# Altium schematic sheet FPGA_GPIO.SchDoc: ARDUINO_SYZGY
size 420 x 297 mm; DrawnBy: Orhun Dabak; Revision: 1.0; SheetNumber: 7; SheetTotal: 7
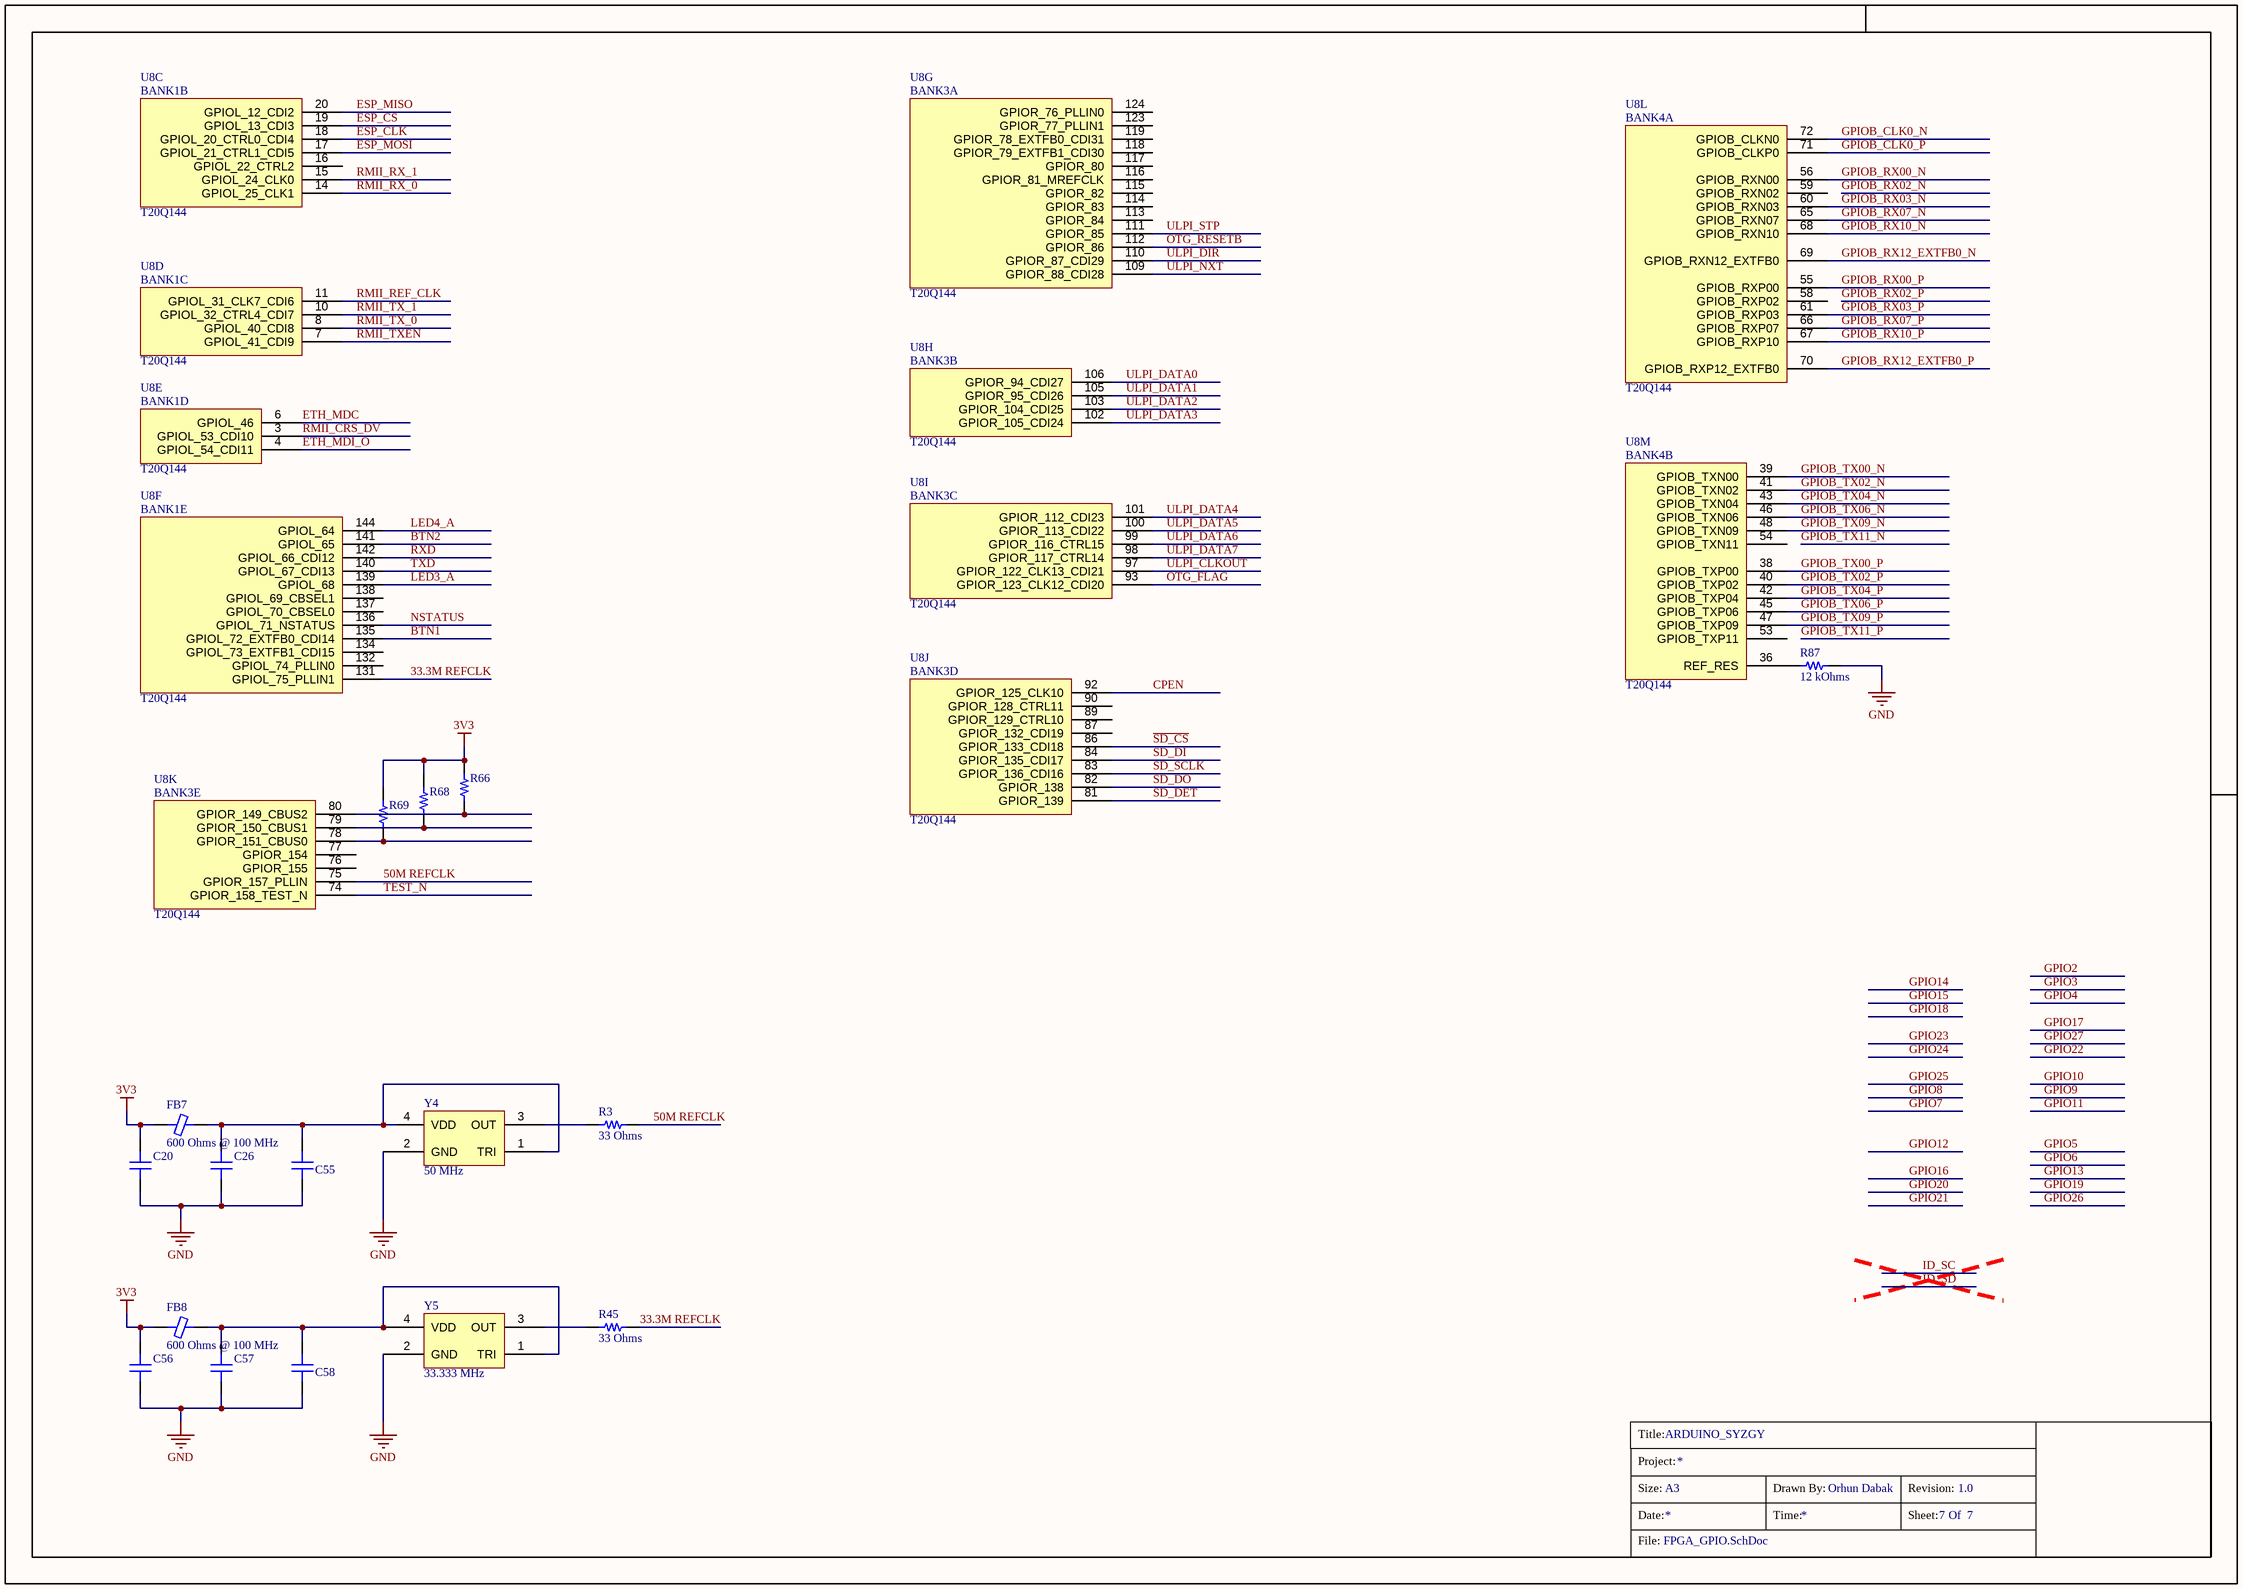
[diagram p0: FPGA_GPIO.SchDoc]

## Parts
?  (no value)  (graphical)
C20  4.7 µF  [CAP 0402_1005]  (value not drawn)
C26  4.7 µF  [CAP 0402_1005]  (value not drawn)
C55  10000 pF  [CAP 0402_1005]  (value not drawn)
C56  4.7 µF  [CAP 0402_1005]  (value not drawn)
C57  4.7 µF  [CAP 0402_1005]  (value not drawn)
C58  10000 pF  [CAP 0402_1005]  (value not drawn)
FB7  600 Ohms @ 100 MHz  [FER 0402_1005]
FB8  600 Ohms @ 100 MHz  [FER 0402_1005]
R3  33 Ohms  [RES 0402_1005]
R45  33 Ohms  [RES 0402_1005]
R66  10 kOhms  [RES 0402_1005]  (value not drawn)
R68  10 kOhms  [RES 0402_1005]  (value not drawn)
R69  10 kOhms  [RES 0402_1005]  (value not drawn)
R87  12 kOhms  [RES 0402_1005]
U8  T20Q144  [CQFP50P2200X2200X160-144N]  (parts C,D,E,F,G,H,I,J,K,L,M of 13)
Y4  50 MHz  [ABRACON ASE]
Y5  33.333 MHz  [ABRACON ASE]

## Nets
3V3: C20.2 C56.2 FB7.1 FB8.1 R66.2 R68.2 R69.2
GND: C20.1 C26.1 C55.1 C56.1 C57.1 C58.1 R87.2 Y4.2(GND) Y5.2(GND)
33.3M REFCLK: R45.2 U8.131(GPIOL_75_PLLIN1)
50M REFCLK: R3.2 U8.75(GPIOR_157_PLLIN)
BTN1: U8.135(GPIOL_72_EXTFB0_CDI14)
BTN2: U8.141(GPIOL_65)
CPEN: U8.92(GPIOR_125_CLK10)
ESP_CLK: U8.18(GPIOL_20_CTRL0_CDI4)
ESP_CS: U8.19(GPIOL_13_CDI3)
ESP_MISO: U8.20(GPIOL_12_CDI2)
ESP_MOSI: U8.17(GPIOL_21_CTRL1_CDI5)
ETH_MDC: U8.6(GPIOL_46)
ETH_MDI_O: U8.4(GPIOL_54_CDI11)
GPIOB_CLK0_N: U8.72(GPIOB_CLKN0)
GPIOB_CLK0_P: U8.71(GPIOB_CLKP0)
GPIOB_RX00_N: U8.56(GPIOB_RXN00)
GPIOB_RX00_P: U8.55(GPIOB_RXP00)
GPIOB_RX03_N: U8.60(GPIOB_RXN03)
GPIOB_RX03_P: U8.61(GPIOB_RXP03)
GPIOB_RX07_N: U8.65(GPIOB_RXN07)
GPIOB_RX07_P: U8.66(GPIOB_RXP07)
GPIOB_RX10_N: U8.68(GPIOB_RXN10)
GPIOB_RX10_P: U8.67(GPIOB_RXP10)
GPIOB_RX12_EXTFB0_N: U8.69(GPIOB_RXN12_EXTFB0)
GPIOB_RX12_EXTFB0_P: U8.70(GPIOB_RXP12_EXTFB0)
GPIOB_TX00_N: U8.39(GPIOB_TXN00)
GPIOB_TX00_P: U8.38(GPIOB_TXP00)
GPIOB_TX02_N: U8.41(GPIOB_TXN02)
GPIOB_TX02_P: U8.40(GPIOB_TXP02)
GPIOB_TX04_N: U8.43(GPIOB_TXN04)
GPIOB_TX04_P: U8.42(GPIOB_TXP04)
GPIOB_TX06_N: U8.46(GPIOB_TXN06)
GPIOB_TX06_P: U8.45(GPIOB_TXP06)
GPIOB_TX09_N: U8.48(GPIOB_TXN09)
GPIOB_TX09_P: U8.47(GPIOB_TXP09)
LED3_A: U8.139(GPIOL_68)
LED4_A: U8.144(GPIOL_64)
NSTATUS: U8.136(GPIOL_71_NSTATUS)
OTG_FLAG: U8.93(GPIOR_123_CLK12_CDI20)
OTG_RESETB: U8.112(GPIOR_86)
RMII_CRS_DV: U8.3(GPIOL_53_CDI10)
RMII_REF_CLK: U8.11(GPIOL_31_CLK7_CDI6)
RMII_RX_0: U8.14(GPIOL_25_CLK1)
RMII_RX_1: U8.15(GPIOL_24_CLK0)
RMII_TX_0: U8.8(GPIOL_40_CDI8)
RMII_TX_1: U8.10(GPIOL_32_CTRL4_CDI7)
RMII_TXEN: U8.7(GPIOL_41_CDI9)
RXD: U8.142(GPIOL_66_CDI12)
~{SD_CS}: U8.86(GPIOR_133_CDI18)
~{SD_DET}: U8.81(GPIOR_139)
SD_DI: U8.84(GPIOR_135_CDI17)
SD_DO: U8.82(GPIOR_138)
SD_SCLK: U8.83(GPIOR_136_CDI16)
TEST_N: U8.74(GPIOR_158_TEST_N)
TXD: U8.140(GPIOL_67_CDI13)
ULPI_CLKOUT: U8.97(GPIOR_122_CLK13_CDI21)
ULPI_DATA0: U8.106(GPIOR_94_CDI27)
ULPI_DATA1: U8.105(GPIOR_95_CDI26)
ULPI_DATA2: U8.103(GPIOR_104_CDI25)
ULPI_DATA3: U8.102(GPIOR_105_CDI24)
ULPI_DATA4: U8.101(GPIOR_112_CDI23)
ULPI_DATA5: U8.100(GPIOR_113_CDI22)
ULPI_DATA6: U8.99(GPIOR_116_CTRL15)
ULPI_DATA7: U8.98(GPIOR_117_CTRL14)
ULPI_DIR: U8.110(GPIOR_87_CDI29)
ULPI_NXT: U8.109(GPIOR_88_CDI28)
ULPI_STP: U8.111(GPIOR_85)
NetC26_2: C26.2 C55.2 FB7.2 Y4.1(TRI) Y4.4(VDD)
NetC57_2: C57.2 C58.2 FB8.2 Y5.1(TRI) Y5.4(VDD)
NetR3_1: R3.1 Y4.3(OUT)
NetR45_1: R45.1 Y5.3(OUT)
NetR66_1: R66.1 U8.80(GPIOR_149_CBUS2)
NetR68_1: R68.1 U8.79(GPIOR_150_CBUS1)
NetR69_1: R69.1 U8.78(GPIOR_151_CBUS0)
NetR87_1: R87.1 U8.36(REF_RES)

Not connected (* = marked no-connect by the designer): U8 16(GPIOL_22_CTRL2) 53(GPIOB_TXP11) 54(GPIOB_TXN11) 58(GPIOB_RXP02) 59(GPIOB_RXN02) 76(GPIOR_155) 77(GPIOR_154) 87(GPIOR_132_CDI19) 89(GPIOR_129_CTRL10) 90(GPIOR_128_CTRL11) 113(GPIOR_84) 114(GPIOR_83) 115(GPIOR_82) 116(GPIOR_81_MREFCLK) 117(GPIOR_80) 118(GPIOR_79_EXTFB1_CDI30) 119(GPIOR_78_EXTFB0_CDI31) 123(GPIOR_77_PLLIN1) 124(GPIOR_76_PLLIN0) 132(GPIOL_74_PLLIN0) 134(GPIOL_73_EXTFB1_CDI15) 137(GPIOL_70_CBSEL0) 138(GPIOL_69_CBSEL1)

## Notes on the sheet
- Title:
- Project:
- Size:
- Date:
- File:
- A3
- Time:
- Drawn By:
- Sheet:
- Revision:
- Of
- (in symbol T20Q144, part C) BANK1B
- (in symbol T20Q144, part D) BANK1C
- (in symbol T20Q144, part E) BANK1D
- (in symbol T20Q144, part F) BANK1E
- (in symbol T20Q144, part G) BANK3A
- (in symbol T20Q144, part H) BANK3B
- (in symbol T20Q144, part I) BANK3C
- (in symbol T20Q144, part J) BANK3D
- (in symbol T20Q144, part K) BANK3E
- (in symbol T20Q144, part L) BANK4A
- (in symbol T20Q144, part M) BANK4B

## Library data of the parts
? = Title_Block
C20 C26 C56 C57 = CL05A475MP5NRNC: CAP CER 4.7UF 10V X5R 0402; manufacturer: Samsung Electro-Mechanics; Tolerance: ±20%; Part Number: CL05A475MP5NRNC; Value: 4.7 µF; Applications: General Purpose; Capacitance: 4.7 µF; componentlink1description: Datasheet; componentlink1url: http://www.samsungsem.com/kr/support/product-search/mlcc/CL05A475MP5NRNC.jsp; componentlink2description: DigiKey Link; componentlink2url: https://www.digikey.com/en/products/detail/samsung-electro-mechanics/CL05A475MP5NRNC/3887140; Device Package: 0402 (1005 Metric); lastupdated: 19/09/2022 12:57:17; Lifecycle Status: Active; Minimum Order: 1; Mounting Type: Surface Mount, MLCC; Operating Temperature: -55°C ~ 85°C; Package / Case: 0402 (1005 Metric); packaging: TapeAndReel; partid: 7650; Part Status: Active; price: 0.01; series: CL; Size / Dimension: 0.039" L x 0.020" W (1.00mm x 0.50mm); Supplier 1: DigiKey; Supplier Part Number 1: 1276-1482-1-ND; Temperature Coefficient: X5R; Thickness (Max): 0.022" (0.55mm); Voltage - Rated: 10V
C55 C58 = C0402C103K5RECAUTO: CAP CER 0402 10NF 50V X7R 10%; manufacturer: KEMET; Part Number: C0402C103K5RECAUTO; Value: 10000 pF; Applications: Automotive, ESD Protection; Capacitance: 10000 pF; componentlink1description: Datasheet; componentlink1url: https://api.kemet.com/component-edge/download/datasheet/C0402C103K5RECAUTO.pdf; componentlink2description: DigiKey Link; componentlink2url: https://www.digikey.com/en/products/detail/kemet/C0402C103K5RECAUTO/8646477; Device Package: 0402 (1005 Metric); lastupdated: 19/09/2022 12:56:43; Lifecycle Status: Active; Minimum Order: 1; Mounting Type: Surface Mount, MLCC; Operating Temperature: -55°C ~ 125°C; Package / Case: 0402 (1005 Metric); packaging: TapeAndReel; partid: 38916; Part Status: Active; price: 0.01; Ratings: AEC-Q200; series: ESD SMD Auto X7R; Size / Dimension: 0.039" L x 0.020" W (1.00mm x 0.50mm); Supplier 1: DigiKey; Supplier Part Number 1: 399-C0402C103K5RECAUTOCT-ND; Temperature Coefficient: X7R; Thickness (Max): 0.022" (0.55mm); Tolerance: ±10%; Voltage - Rated: 50V
FB7 FB8 = BLM15AG601SN1D: FERRITE BEAD 600 OHM 0402 1LN; Manufacturer: Murata Electronics; Current Rating (Max): 300mA; DC Resistance (DCR) (Max): 520mOhm; Number of Lines: 1; Part Number: BLM15AG601SN1D; ComponentLink1Description: Datasheet; ComponentLink1URL: https://www.murata.com/en-us/products/productdata/8796740059166/ENFA0018.pdf; ComponentLink2Description: DigiKey Link; ComponentLink2URL: https://www.digikey.com/en/products/detail/murata-electronics/BLM15AG601SN1D/584217; Device Package: 0402 (1005 Metric); Height (Max): 0.022" (0.55mm); Impedance @ Frequency: 600 Ohms @ 100 MHz; LastUpdated: 1/26/2023 08:43:34 PM; Lifecycle Status: Active; Minimum Order: 1; Mounting Type: Surface Mount; Operating Temperature: -55°C ~ 125°C; Package / Case: 0402 (1005 Metric); Packaging: TapeAndReel; PartId: 386; Part Status: Active; Price: 0.01; Series: EMIFIL®, BLM15; Size / Dimension: 0.039" L x 0.022" W (1.00mm x 0.55mm); Supplier 1: DigiKey; Supplier Part Number 1: 490-1006-1-ND; Value: 600 Ohms @ 100 MHz
R3 R45 = RC0402FR-0733RL: RES 33 OHM 1% 1/16W 0402; Manufacturer: Yageo; Power (Watts): 0.063W, 1/16W; Temperature Coefficient: ±100ppm/°C; Part Number: RC0402FR-0733RL; Value: 33 Ohms; ComponentLink1Description: Datasheet; ComponentLink1URL: https://www.yageo.com/upload/media/product/productsearch/datasheet/rchip/PYu-RC_Group_51_RoHS_L_10.pdf; ComponentLink2Description: DigiKey Link; ComponentLink2URL: https://www.digikey.com/en/products/detail/yageo/RC0402FR-0733RL/726593; Composition: Thick Film; Device Package: 0402 (1005 Metric); Features: Moisture Resistant; Height - Seated (Max): 0.016" (0.40mm); LastUpdated: 19/09/2022 13:14:04; Lifecycle Status: Active; Minimum Order: 1; Number of Terminations: 2; Operating Temperature: -55°C ~ 155°C; Package / Case: 0402 (1005 Metric); Packaging: CutTape; PartId: 20555; Part Status: Active; Price: 0.01; Resistance: 33 Ohms; Series: RC_L; Size / Dimension: 0.039" L x 0.020" W (1.00mm x 0.50mm); Supplier 1: DigiKey; Supplier Part Number 1: 311-33.0LRCT-ND; Supplier Device Package: 0402; Tolerance: ±1%
R66 R68 R69 = RP73PF1E10KBTD: RES 10K OHM 0.1% 1/10W 0402; Manufacturer: TE Connectivity Passive Product; Power (Watts): 0.1W, 1/10W; Temperature Coefficient: ±25ppm/°C; Part Number: RP73PF1E10KBTD; Value: 10 kOhms; ComponentLink1Description: Datasheet; ComponentLink1URL: https://www.te.com/commerce/DocumentDelivery/DDEController?Action=srchrtrv&DocNm=1773272&DocType=DS&DocLang=English; ComponentLink2Description: DigiKey Link; ComponentLink2URL: https://www.digikey.com/en/products/detail/te-connectivity-passive-product/RP73PF1E10KBTD/8260957; Composition: Thin Film; Device Package: 0402 (1005 Metric); Height - Seated (Max): 0.014" (0.35mm); LastUpdated: 9/19/2022 01:15:04 PM; Lifecycle Status: Active; Minimum Order: 1; Number of Terminations: 2; Operating Temperature: -55°C ~ 155°C; Package / Case: 0402 (1005 Metric); Packaging: TapeAndReel; PartId: 2434; Part Status: Active; Price: 0.09; Resistance: 10 kOhms; Series: RP73, Holsworthy; Size / Dimension: 0.039" L x 0.020" W (1.00mm x 0.50mm); Supplier 1: DigiKey; Supplier Part Number 1: A127415CT-ND; Supplier Device Package: 0402; Tolerance: ±0.1%
R87 = RMCF0402FT12K0: RES 12K OHM 1% 1/16W 0402; Manufacturer: Stackpole Electronics Inc; Power (Watts): 0.063W, 1/16W; Temperature Coefficient: ±100ppm/°C; Part Number: RMCF0402FT12K0; Value: 12 kOhms; ComponentLink1Description: Datasheet; ComponentLink1URL: https://www.seielect.com/catalog/sei-rmcf_rmcp.pdf; ComponentLink2Description: DigiKey Link; ComponentLink2URL: https://www.digikey.com/en/products/detail/stackpole-electronics-inc/RMCF0402FT12K0/1714419; Composition: Thick Film; Device Package: 0402 (1005 Metric); Features: Automotive AEC-Q200; Height - Seated (Max): 0.016" (0.40mm); LastUpdated: 2/18/2023 08:21:51 PM; Lifecycle Status: Active; Minimum Order: 1; Number of Terminations: 2; Operating Temperature: -55°C ~ 155°C; Package / Case: 0402 (1005 Metric); Packaging: CutTape; PartId: 4499; Part Status: Active; Price: 0.01; Ratings: AEC-Q200; Resistance: 12 kOhms; Series: RMCF; Size / Dimension: 0.039" L x 0.020" W (1.00mm x 0.50mm); Supplier 1: DigiKey; Supplier Part Number 1: RMCF0402FT12K0CT-ND; Supplier Device Package: 0402; Tolerance: ±1%
U8 = T20Q144: Trion® Field Programmable Gate Array (FPGA) IC 97 1044 19728 144-LQFP
Y4 = ASE-50.000MHZ-ET: XTAL OSC XO 50.0000MHZ CMOS SMD; Manufacturer: Abracon LLC; Base Resonator: Crystal; Current - Supply (Max): 19mA; Frequency Stability: ±100ppm; Function: Enable/Disable; Voltage - Supply: 3.3V; Part Number: ASE-50.000MHZ-ET; ComponentLink1Description: Datasheet; ComponentLink1URL: https://abracon.com/Oscillators/ASEseries.pdf; ComponentLink2Description: DigiKey Link; ComponentLink2URL: https://www.digikey.com/en/products/detail/abracon-llc/ASE-50-000MHZ-ET/2001363; Frequency: 50 MHz; Height - Seated (Max): 0.047" (1.20mm); LastUpdated: 1/25/2023 08:51:43 PM; Lifecycle Status: Active; Minimum Order: 1; Mounting Type: Surface Mount; Operating Temperature: -20°C ~ 70°C; Output: CMOS; Package / Case: 4-SMD, No Lead; Packaging: TapeAndReel; PartId: 115; Part Status: Active; Price: 0.70; Series: ASE; Size / Dimension: 0.126" L x 0.098" W (3.20mm x 2.50mm); Supplier 1: DigiKey; Supplier Part Number 1: 535-9996-1-ND; Type: XO (Standard); Value: 50 MHz
Y5 = ASE-33.333MHZ-LC-T: XTAL OSC XO 33.3330MHZ CMOS SMD; Manufacturer: Abracon LLC; Base Resonator: Crystal; Current - Supply (Max): 13mA; Frequency Stability: ±50ppm; Function: Enable/Disable; Voltage - Supply: 3.3V; Part Number: ASE-33.333MHZ-LC-T; ComponentLink1Description: Datasheet; ComponentLink1URL: https://abracon.com/Oscillators/ASEseries.pdf; ComponentLink2Description: DigiKey Link; ComponentLink2URL: https://www.digikey.com/en/products/detail/abracon-llc/ASE-33-333MHZ-LC-T/1236891; Frequency: 33.333 MHz; Height - Seated (Max): 0.047" (1.20mm); LastUpdated: 1/25/2023 08:51:43 PM; Lifecycle Status: Active; Minimum Order: 1; Mounting Type: Surface Mount; Operating Temperature: -40°C ~ 85°C; Output: CMOS; Package / Case: 4-SMD, No Lead; Packaging: TapeAndReel; PartId: 128; Part Status: Active; Price: 0.76; Series: ASE; Size / Dimension: 0.126" L x 0.098" W (3.20mm x 2.50mm); Supplier 1: DigiKey; Supplier Part Number 1: 535-9574-1-ND; Type: XO (Standard); Value: 33.333 MHz